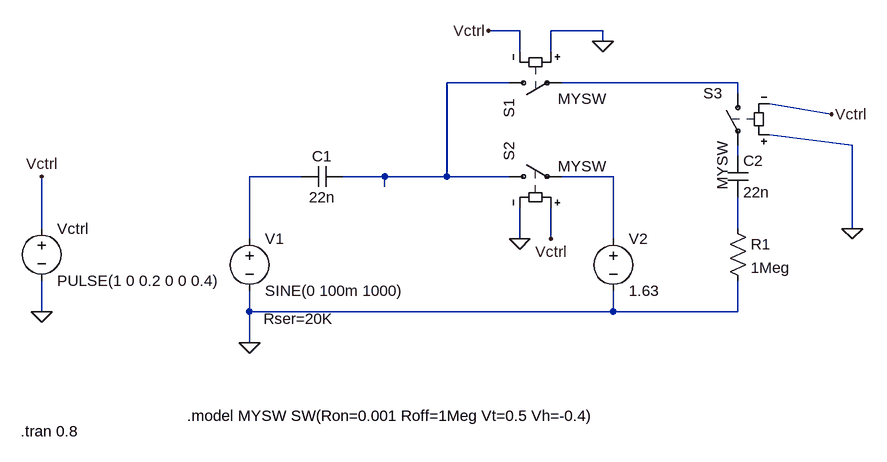
[diagram p0: schematic Stomp_Button_Pop_Investigation.asc]
Stomp_Button_Pop_Investigation.asc, the LTspice schematic file:
Version 4
SHEET 1 1000 680
WIRE 448 -176 400 -176
WIRE 576 -176 496 -176
WIRE 576 -160 576 -176
WIRE 448 -144 448 -176
WIRE 496 -144 496 -176
WIRE 432 -96 336 -96
WIRE 784 -96 512 -96
WIRE 784 -80 784 -96
WIRE 928 -48 832 -64
WIRE 960 0 832 -16
WIRE 784 16 784 0
WIRE 112 48 32 48
WIRE 240 48 176 48
WIRE 336 48 336 -96
WIRE 336 48 240 48
WIRE 432 48 336 48
WIRE 592 48 512 48
WIRE 240 64 240 48
WIRE -288 128 -288 48
WIRE 784 128 784 80
WIRE 960 128 960 0
WIRE 32 144 32 48
WIRE 448 144 448 96
WIRE 496 144 496 96
WIRE 592 144 592 48
WIRE -288 256 -288 208
WIRE 32 256 32 224
WIRE 592 256 592 224
WIRE 592 256 32 256
WIRE 784 256 784 208
WIRE 784 256 592 256
WIRE 32 304 32 256
FLAG 32 304 0
FLAG -288 256 0
FLAG -288 48 Vctrl
FLAG 400 -176 Vctrl
FLAG 576 -160 0
FLAG 496 144 Vctrl
FLAG 448 144 0
FLAG 928 -48 Vctrl
FLAG 960 128 0
SYMBOL voltage 32 128 R0
WINDOW 123 0 0 Left 0
WINDOW 39 22 139 Left 2
SYMATTR SpiceLine Rser=20K
SYMATTR InstName V1
SYMATTR Value SINE(0 100m 1000)
SYMBOL voltage 592 128 R0
WINDOW 123 0 0 Left 0
WINDOW 39 0 0 Left 0
SYMATTR InstName V2
SYMATTR Value 1.63
SYMBOL cap 176 32 R90
WINDOW 0 0 32 VBottom 2
WINDOW 3 32 32 VTop 2
SYMATTR InstName C1
SYMATTR Value 22n
SYMBOL sw 416 -96 M90
WINDOW 3 24 165 VLeft 2
SYMATTR Value MYSW
SYMATTR InstName S1
SYMBOL sw 416 48 R270
WINDOW 3 16 91 VRight 2
SYMATTR Value MYSW
SYMATTR InstName S2
SYMBOL res 768 112 R0
SYMATTR InstName R1
SYMATTR Value 1Meg
SYMBOL voltage -288 112 R0
WINDOW 123 0 0 Left 0
WINDOW 39 0 0 Left 0
SYMATTR InstName Vctrl
SYMATTR Value PULSE(1 0 0.2 0 0 0.4)
SYMBOL sw 784 -96 M0
WINDOW 3 24 165 VLeft 2
SYMATTR Value MYSW
SYMATTR InstName S3
SYMBOL cap 768 16 R0
SYMATTR InstName C2
SYMATTR Value 22n
TEXT -64 416 Left 2 !.model MYSW SW(Ron=0.001 Roff=1Meg Vt=0.5 Vh=-0.4)
TEXT -320 440 Left 2 !.tran 0.8

The netlist it stands for:
* Stomp_Button_Pop_Investigation.asc
V1 N004 0 SINE(0 100m 1000) Rser=20K
V2 N005 0 1.63
C1 N001 N004 22n
S1 N001 N002 0 Vctrl MYSW
S2 N001 N005 Vctrl 0 MYSW
R1 N006 0 1Meg
Vctrl Vctrl 0 PULSE(1 0 0.2 0 0 0.4)
S3 N002 N003 0 Vctrl MYSW
C2 N003 N006 22n
.model MYSW SW(Ron=0.001 Roff=1Meg Vt=0.5 Vh=-0.4)
.tran 0.8
.backanno
.end